# EasyEDA Pro project MotherBoard.eprj

# Schematic Schematic1
Create Date: 2024-03-08; Page Name: P1; Project Name: 机甲杯主控; Schematic Name: Schematic1; Update Date: 2024-03-14; Company: 嘉立创EDA; Page Size: A4; Version: V1.0
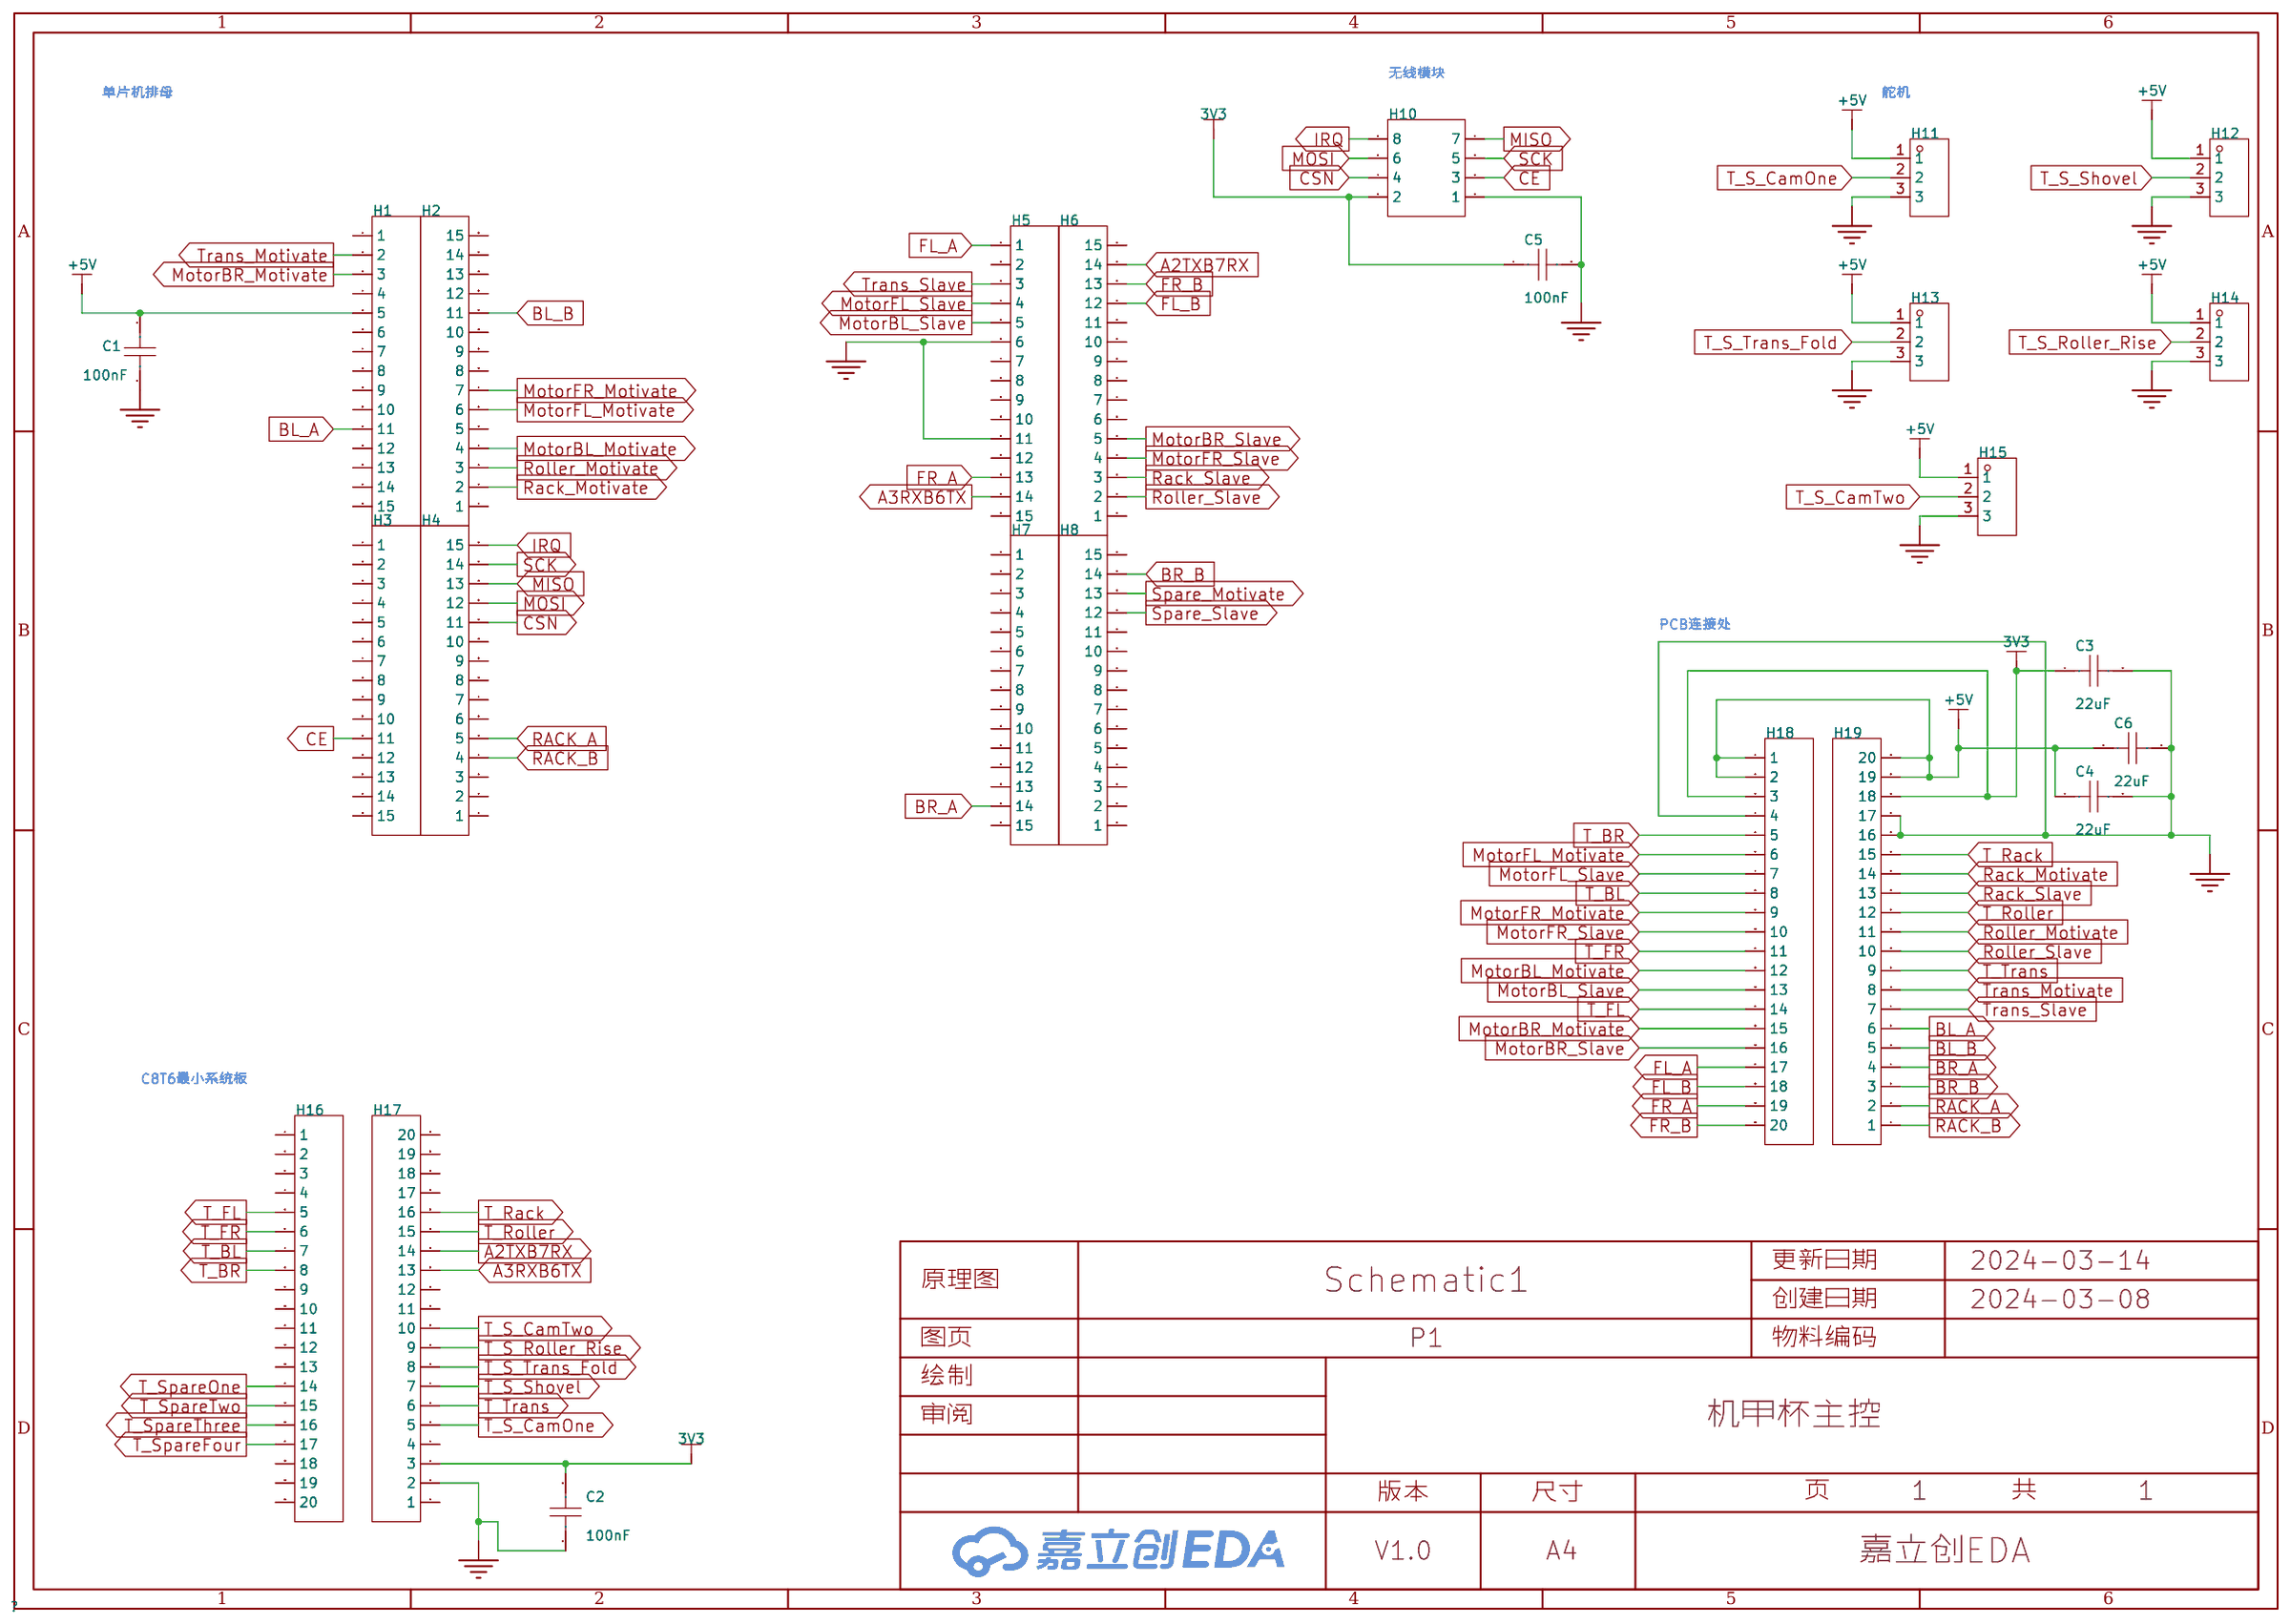
[diagram p0: schematic sheet]

## Parts
C1  100nF  [C0603]
C2  100nF  [C0603]
C3  22uF  [C0603]
C4  22uF  [C0603]
C5  100nF  [C0603]
C6  22uF  [C0603]
H1  -  [HDR-TH_15P-P2.54-V-F-1]
H2  -  [HDR-TH_15P-P2.54-V-F-1]
H3  -  [HDR-TH_15P-P2.54-V-F-1]
H4  -  [HDR-TH_15P-P2.54-V-F-1]
H5  -  [HDR-TH_15P-P2.54-V-F-1]
H6  -  [HDR-TH_15P-P2.54-V-F-1]
H7  -  [HDR-TH_15P-P2.54-V-F-1]
H8  -  [HDR-TH_15P-P2.54-V-F-1]
H10  -  [HDR-TH_8P-P2.54-V-F-R2-C4-S2.54-1]
H11  -  [HDR-TH_3P-P2.54-V-M]
H12  -  [HDR-TH_3P-P2.54-V-M]
H13  -  [HDR-TH_3P-P2.54-V-M]
H14  -  [HDR-TH_3P-P2.54-V-M]
H15  -  [HDR-TH_3P-P2.54-V-M]
H16  -  [HDR-TH_20P-P2.54-V-F]
H17  -  [HDR-TH_20P-P2.54-V-F]
H18  -  [HDR-TH_20P-P2.54-V-F]
H19  -  [HDR-TH_20P-P2.54-V-F]

## Library data of the parts
C1-C6 = CAP_0603: Supplier Footprint: 0603
H1-H8 = HDR-F_2.54_1x15P: Supplier Part: C124408; Supplier Footprint: 插件,
H10 = HDR-F_2.54_2x4: Supplier Part: C92271; Supplier Footprint: 插件
H11-H15 = HDR-M_2.54_1x3P: Supplier Part: C2937625; Supplier Footprint: 插件
H16-H19 = HDR-F_2.54_1x20P: Supplier Part: C50984; Supplier Footprint: 插件

## Nets
3V3: C2.2 C3.1 C5.1 H10.2 H17.3 H18.3 H19.18
+5V: C1.2 C4.1 C6.2 H1.5 H11.1 H12.1 H13.1 H14.1 H15.1 H18.1 H18.2 H19.19 H19.20
GND: C1.1 C2.1 C3.2 C4.2 C5.2 C6.1 H5.6 H5.11 H10.1 H11.3 H12.3 H13.3 H14.3 H15.3 H17.2 H18.4 H19.16 H19.17
A2TXB7RX: H6.14 H17.14
A3RXB6TX: H5.14 H17.13
BL_A: H1.11 H19.6
BL_B: H2.11 H19.5
BR_A: H7.14 H19.4
BR_B: H8.14 H19.3
CE: H3.11 H10.3
CSN: H4.11 H10.4
FL_A: H5.1 H18.17
FL_B: H6.12 H18.18
FR_A: H5.13 H18.19
FR_B: H6.13 H18.20
IRQ: H4.15 H10.8
MISO: H4.13 H10.7
MOSI: H4.12 H10.6
MotorBL_Motivate: H2.4 H18.12
MotorBL_Slave: H5.5 H18.13
MotorBR_Motivate: H1.3 H18.15
MotorBR_Slave: H6.5 H18.16
MotorFL_Motivate: H2.6 H18.6
MotorFL_Slave: H5.4 H18.7
MotorFR_Motivate: H2.7 H18.9
MotorFR_Slave: H6.4 H18.10
RACK_A: H4.5 H19.2
RACK_B: H4.4 H19.1
Rack_Motivate: H2.2 H19.14
Rack_Slave: H6.3 H19.13
Roller_Motivate: H2.3 H19.11
Roller_Slave: H6.2 H19.10
SCK: H4.14 H10.5
Spare_Motivate: H8.13
Spare_Slave: H8.12
T_BL: H16.7 H18.8
T_BR: H16.8 H18.5
T_FL: H16.5 H18.14
T_FR: H16.6 H18.11
T_Rack: H17.16 H19.15
T_Roller: H17.15 H19.12
T_S_CamOne: H11.2 H17.5
T_S_CamTwo: H15.2 H17.10
T_S_Roller_Rise: H14.2 H17.9
T_S_Shovel: H12.2 H17.7
T_S_Trans_Fold: H13.2 H17.8
T_SpareFour: H16.17
T_SpareOne: H16.14
T_SpareThree: H16.16
T_SpareTwo: H16.15
T_Trans: H17.6 H19.9
Trans_Motivate: H1.2 H19.8
Trans_Slave: H5.3 H19.7

Not connected (* = marked no-connect by the designer): H1 1 4 6 7 8 9 10 12 13 14 15; H2 1 5 8 9 10 12 13 14 15; H3 1 2 3 4 5 6 7 8 9 10 12 13 14 15; H4 1 2 3 6 7 8 9 10; H5 2 7 8 9 10 12 15; H6 1 6 7 8 9 10 11 15; H7 1 2 3 4 5 6 7 8 9 10 11 12 13 15; H8 1 2 3 4 5 6 7 8 9 10 11 15; H16 1 2 3 4 9 10 11 12 13 18 19 20; H17 1 4 11 12 17 18 19 20

## Notes on the sheet
- 无线模块
- 单片机排母
- 舵机
- PCB连接处
- C8T6最小系统板

# Board PCB1
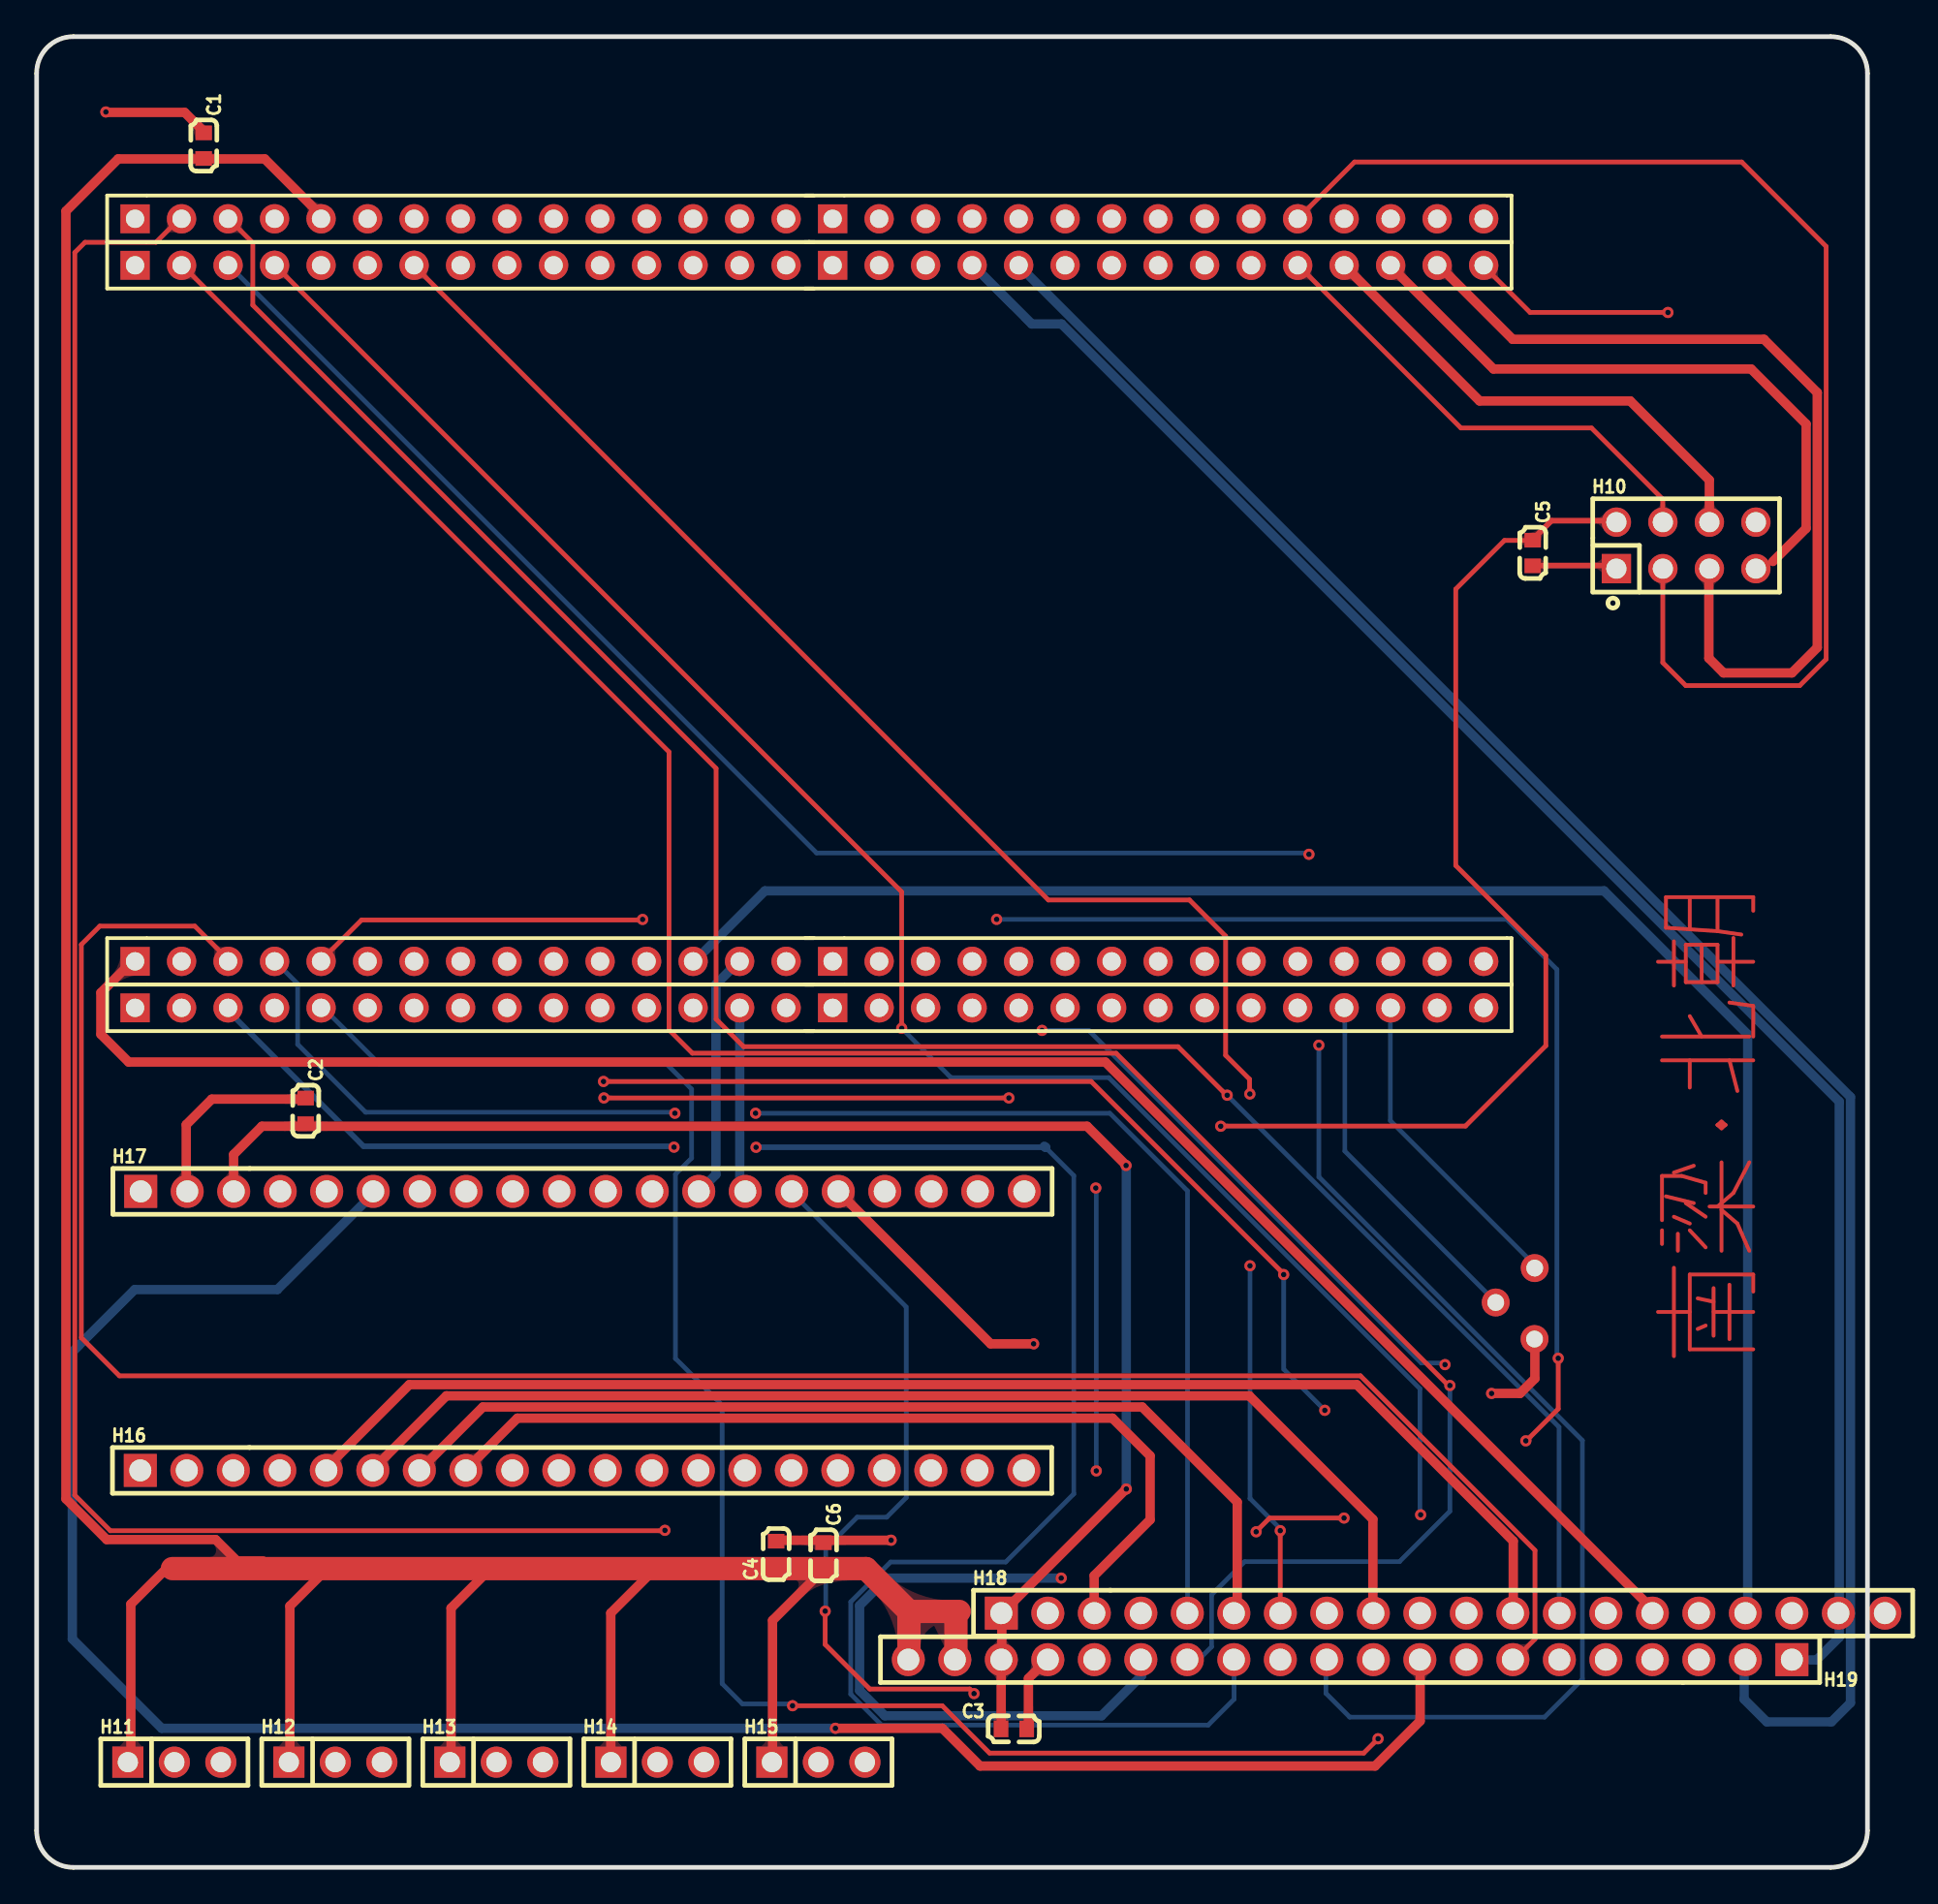
[diagram p1: board, top side]
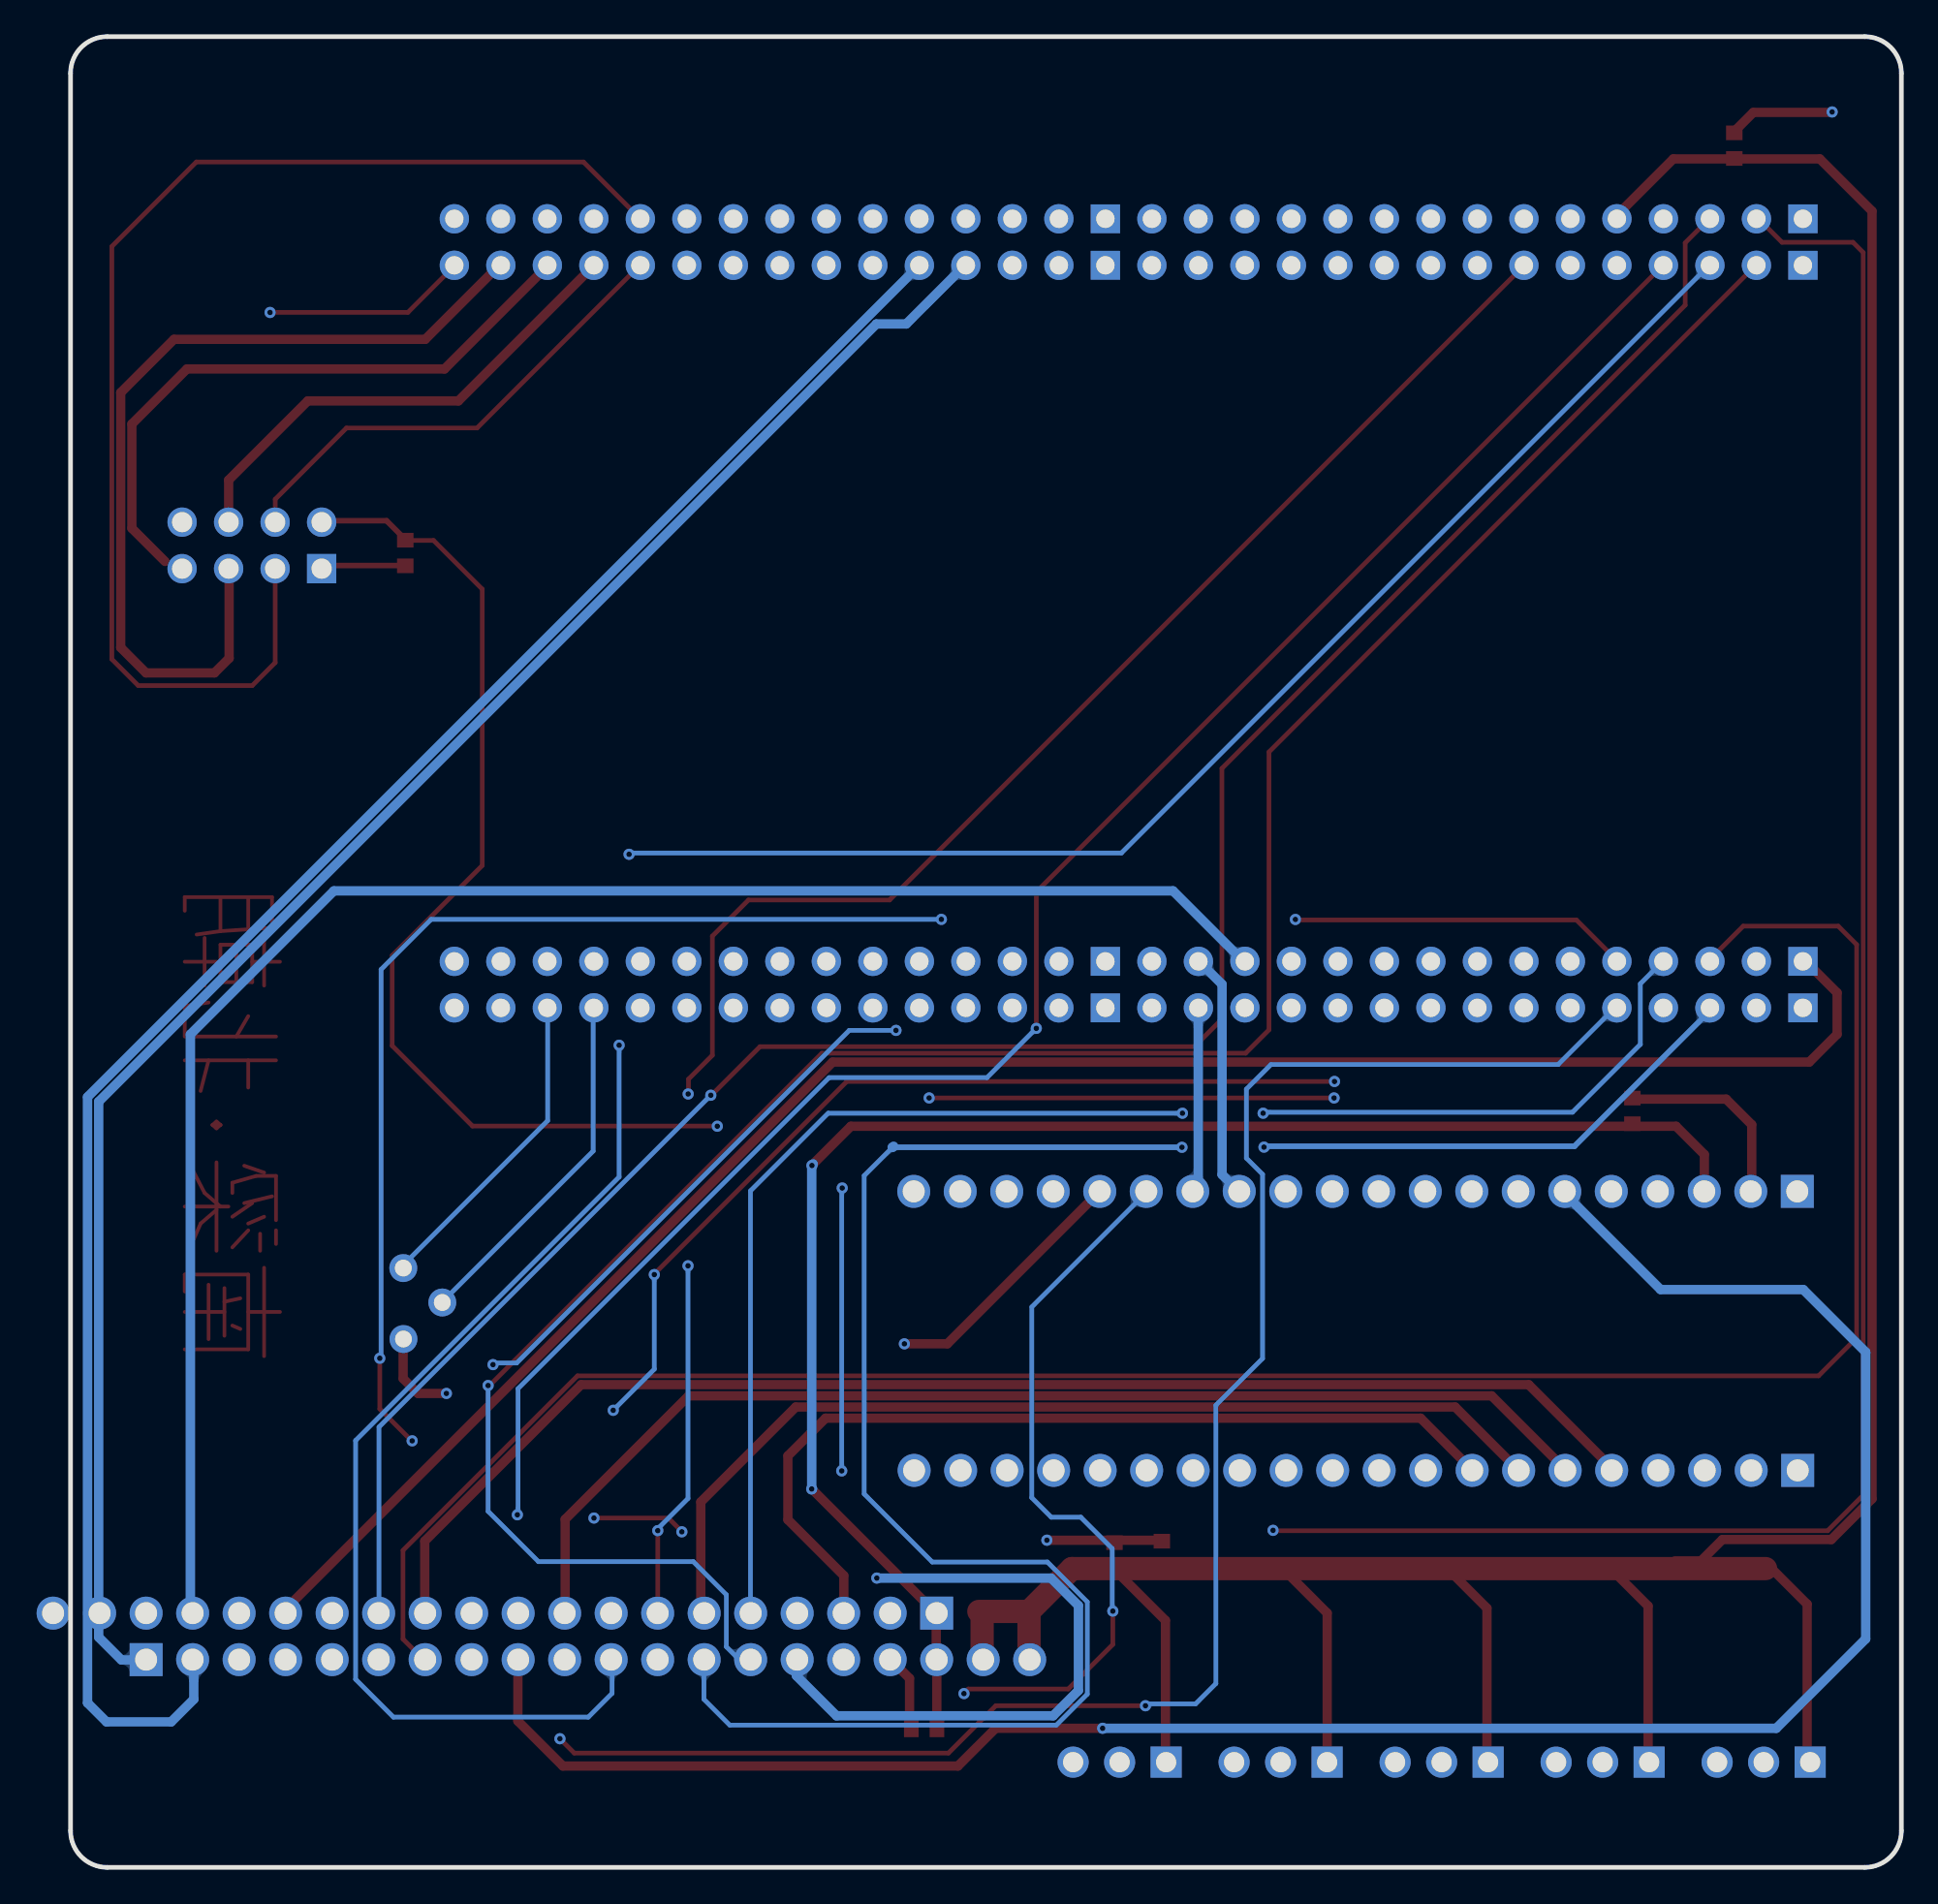
[diagram p2: board, bottom side, seen from below]

Outline 100 x 100 mm; copper layers: Top Layer, Inner1, Inner2, Bottom Layer. Coordinates in mm from the lower left corner of the outline.
Outline path: 0,98 0,2 arc(0.59,0.59) 2,0 98,0 arc(99.41,0.59) 100,2 100,98 arc(99.41,99.41) 98,100 2,100 arc(0.59,99.41) 0,98
Stack: Top Layer 0.035mm 外层铜厚1oz / Dielectric1 0.2104mm 7628 RC49% 8.6mil / Inner1 0.0152mm 内层铜厚 / Dielectric2 1.065mm 1.1mm H/HOZ 含铜 / Inner2 0.0152mm 内层铜厚 / Dielectric3 0.2104mm 7628 RC49% 8.6mil / Bottom Layer 0.035mm 外层铜厚1oz

## Design rules (mm)
template: JLCPCB Capability(Two Layers Board)
spacing copperThickness1oz (default): track to track 0.102, other pairs 0.152 to 0.3
spacing copperThickness2oz: track to track 0.203, other pairs 0.152 to 0.3
track width copperThickness1oz (default): min 0.127, default 0.254, max 2.54
track width copperThickness2oz: min 0.203, default 0.254, max 2.54
differential pair differentialPair (default): width min 0.127, default 0.254, max 2.54; gap min 0.152, default 0.152
via viaSize (default): diameter min 0.5, default 0.61, max 10; hole min 0.3, default 0.305, max 6.3

## Placement (name value [footprint] x y rotation side)
C1  100nF  [C0603]  9.13 94.04 270 top
C2  100nF  [C0603]  14.69 41.32 270 top
C3  22uF  [C0603]  53.38 7.56 0 top
C4  22uF  [C0603]  40.39 17.12 90 top
C5  100nF  [C0603]  81.71 71.79 270 top
C6  22uF  [C0603]  42.98 17.04 270 top
H1  -  [HDR-TH_15P-P2.54-V-F-1]  23.16 90.05 0 top
H2  -  [HDR-TH_15P-P2.54-V-F-1]  23.16 87.51 0 top
H3  -  [HDR-TH_15P-P2.54-V-F-1]  61.26 90.05 0 top
H4  -  [HDR-TH_15P-P2.54-V-F-1]  61.26 87.51 0 top
H5  -  [HDR-TH_15P-P2.54-V-F-1]  23.16 49.49 0 top
H6  -  [HDR-TH_15P-P2.54-V-F-1]  23.16 46.95 0 top
H7  -  [HDR-TH_15P-P2.54-V-F-1]  61.26 49.49 0 top
H8  -  [HDR-TH_15P-P2.54-V-F-1]  61.26 46.95 0 top
H10  -  [HDR-TH_8P-P2.54-V-F-R2-C4-S2.54-1]  90.09 72.21 0 top
H11  -  [HDR-TH_3P-P2.54-V-M]  7.52 5.75 0 top
H12  -  [HDR-TH_3P-P2.54-V-M]  16.32 5.75 0 top
H13  -  [HDR-TH_3P-P2.54-V-M]  25.11 5.75 0 top
H14  -  [HDR-TH_3P-P2.54-V-M]  33.91 5.75 0 top
H15  -  [HDR-TH_3P-P2.54-V-M]  42.7 5.75 0 top
H16  -  [HDR-TH_20P-P2.54-V-F]  29.79 21.68 0 top
H17  -  [HDR-TH_20P-P2.54-V-F]  29.82 36.92 0 top
H18  -  [HDR-TH_20P-P2.54-V-F]  76.82 13.89 0 top
H19  -  [HDR-TH_20P-P2.54-V-F]  71.74 11.35 180 top
NOREF  -  [Pad_e215]  79.69 30.86 0 top
NOREF#2  -  [Pad_e217]  81.82 32.74 0 top
NOREF#3  -  [Pad_e162]  81.82 28.86 0 top

## Footprints (pads in the part's own frame, mm; a bottom-side part is the same pattern mirrored in y, then rotated)
C0603
  rect 0.8x0.9 smd: 1(-0.7,0) 2(0.7,0)
HDR-TH_3P-P2.54-V-M
  rect 1.7x1.7 hole 1.1: 1(-2.54,0)
  round 1.7 hole 1.1: 2(0,0) 3(2.54,0)
HDR-TH_8P-P2.54-V-F-R2-C4-S2.54-1
  rect 1.6x1.6 hole 1.1: 1(-3.81,-1.27)
  round 1.6 hole 1.1: 2(-3.81,1.27) 3(-1.27,-1.27) 4(-1.27,1.27) 5(1.27,-1.27) 6(1.27,1.27) 7(3.81,-1.27) 8(3.81,1.27)
HDR-TH_15P-P2.54-V-F-1
  rect 1.6x1.575 hole 1: 1(-17.78,0)
  round 1.6 hole 1: 2(-15.24,0) 3(-12.7,0) 4(-10.16,0) 5(-7.62,0) 6(-5.08,0) 7(-2.54,0) 8(0,0) 9(2.54,0) 10(5.08,0) 11(7.62,0) 12(10.16,0) 13(12.7,0) 14(15.24,0) 15(17.78,0)
HDR-TH_20P-P2.54-V-F
  rect 1.8x1.8 hole 1.2: 1(-24.13,0)
  round 1.8 hole 1.2: 2(-21.59,0) 3(-19.05,0) 4(-16.51,0) 5(-13.97,0) 6(-11.43,0) 7(-8.89,0) 8(-6.35,0) 9(-3.81,0) 10(-1.27,0) 11(1.27,0) 12(3.81,0) 13(6.35,0) 14(8.89,0) 15(11.43,0) 16(13.97,0) 17(16.51,0) 18(19.05,0) 19(21.59,0) 20(24.13,0)
Pad_e162
  round 1.524 hole 0.914: 1(0,0)
Pad_e215
  round 1.524 hole 0.914: 2(0,0)
Pad_e217
  round 1.524 hole 0.914: 3(0,0)

## Nets
3V3: C2.2 C3.1 C5.1 H10.2 H17.3 H18.3 H19.18
+5V: C1.2 C4.1 C6.2 H1.5 H11.1 H12.1 H13.1 H14.1 H15.1 H18.1 H18.2 H19.19 H19.20
GND: C1.1 C2.1 C3.2 C4.2 C5.2 C6.1 H5.6 H5.11 H10.1 H11.3 H12.3 H13.3 H14.3 H15.3 H17.2 H18.4 H19.16 H19.17
A2TXB7RX: H6.14 H17.14
A3RXB6TX: H5.14 H17.13
BL_A: H1.11 H19.6
BL_B: H2.11 H19.5
BR_A: H7.14 H19.4
BR_B: H8.14 H19.3
CE: H3.11 H10.3
CSN: H4.11 H10.4
FL_A: H5.1 H18.17
FL_B: H6.12 H18.18
FR_A: H5.13 H18.19
FR_B: H6.13 H18.20
IRQ: H4.15 H10.8
MISO: H4.13 H10.7
MOSI: H4.12 H10.6
MOTORBL_MOTIVATE: H2.4 H18.12
MOTORBL_SLAVE: H5.5 H18.13
MOTORBR_MOTIVATE: H1.3 H18.15
MOTORBR_SLAVE: H6.5 H18.16
MOTORFL_MOTIVATE: H2.6 H18.6
MOTORFL_SLAVE: H5.4 H18.7
MOTORFR_MOTIVATE: H2.7 H18.9
MOTORFR_SLAVE: H6.4 H18.10
RACK_A: H4.5 H19.2
RACK_B: H4.4 H19.1
RACK_MOTIVATE: H2.2 H19.14
RACK_SLAVE: H6.3 H19.13
ROLLER_MOTIVATE: H2.3 H19.11
ROLLER_SLAVE: H6.2 H19.10
SCK: H4.14 H10.5
SPARE_MOTIVATE: H8.13 NOREF#2.3
SPARE_SLAVE: H8.12 NOREF.2
T_BL: H16.7 H18.8
T_BR: H16.8 H18.5
T_FL: H16.5 H18.14
T_FR: H16.6 H18.11
T_RACK: H17.16 H19.15
T_ROLLER: H17.15 H19.12
T_S_CAMONE: H11.2 H17.5
T_S_CAMTWO: H15.2 H17.10
T_S_ROLLER_RISE: H14.2 H17.9
T_S_SHOVEL: H12.2 H17.7
T_S_TRANS_FOLD: H13.2 H17.8
T_SPAREFOUR: H16.17
T_SPAREONE: H16.14 NOREF#3.1
T_SPARETHREE: H16.16
T_SPARETWO: H16.15
T_TRANS: H17.6 H19.9
TRANS_MOTIVATE: H1.2 H19.8
TRANS_SLAVE: H5.3 H19.7

Pads without a net: H1 1 4 6 7 8 9 10 12 13 14 15; H2 1 5 8 9 10 12 13 14 15; H3 1 2 3 4 5 6 7 8 9 10 12 13 14 15; H4 1 2 3 6 7 8 9 10; H5 2 7 8 9 10 12 15; H6 1 6 7 8 9 10 11 15; H7 1 2 3 4 5 6 7 8 9 10 11 12 13 15; H8 1 2 3 4 5 6 7 8 9 10 11 15; H16 1 2 3 4 9 10 11 12 13 18 19 20; H17 1 4 11 12 17 18 19 20

## Via types
v1: diameter 0.61, hole 0.305, Top Layer to Bottom Layer, 43 vias

## Routing (per net, layer and track width the routed paths; a pad name or vN(x,y) marks a point on that pad's centre or on a via; arc(x,y) is an arc through that point)
3V3: length 149.3
  Top Layer w0.254: 81.76,72.48 80.17,72.48 77.51,69.82 77.51,54.72 82.43,49.8 82.43,44.88 78.04,40.49 64.65,40.49
  Top Layer w0.305: 81.79,72.61 82.74,73.56 86.33,73.56
  Top Layer w0.508: 52.68,11.18 52.68,7.68 ; 52.68,11.18 52.68,11.37 52.65,11.4 ; 52.68,11.18 52.72,11.22 52.72,13.92 ; 10.91,36.73 10.76,36.88 10.76,38.94 12.31,40.48 57.38,40.48 59.49,38.37 ; 52.73,13.89 59.49,20.65
  Inner1 w0.254: v1(59.5,38.34) 61.65,40.48 v1(64.67,40.48)
  Bottom Layer w0.508: 59.44,38.43 59.52,38.35 v1(59.52,20.67)
+5V: length 205.8
  Top Layer w0.508: 13.83,5.7 13.83,14.28 15.79,16.24 ; 33.71,16.24 31.36,13.89 31.36,5.67 ; 12.37,16.74 10.94,16.74 9.78,17.91 3.83,17.91 1.6,20.13 1.6,90.47 4.46,93.32 12.46,93.32 15.61,90.16 ; 43.04,16.33 43.03,16.32 40.2,13.49 40.2,5.88 ; 24.75,16.27 22.64,14.16 22.64,5.7 ; 5.15,5.67 5.15,14.38 7.1,16.33
  Top Layer w1.27: 7.42,16.32 45.3,16.32 47.69,13.94 ; 50.21,13.85 50.21,11.5 50.05,11.34 ; 47.65,11.21 47.65,13.88 ; 47.65,13.88 47.75,13.98 50.39,13.98 ; 47.65,13.88 47.65,13.9
GND: length 327.2
  Top Layer w0.305: 81.71,71.11 86.25,71.11 86.27,71.08
  Top Layer w0.508: 8.17,36.83 8.17,40.57 9.57,41.96 14.42,41.96 ; 46.55,17.88 46.53,17.87 40.4,17.87 ; 54.17,7.55 54.17,10.32 55.15,11.3 ; 3.86,95.86 8.09,95.86 9.11,94.83
  Inner2 w0.508: 37.46,2.57 36.44,3.59 36.44,5.69 ; 45.2,5.72 45.2,4.05 46.71,2.54 ; 10.07,5.75 10.07,3.72 11.2,2.59 ; 8.22,36.94 5.88,34.6 2.57,34.6 1.27,35.9 1.27,52.93 4.11,55.78 20.02,55.78 ; 30.58,53.89 30.73,53.73 30.73,49.46 ; 59.21,2.28 59.21,10.02 57.8,11.43 ; v1(3.78,95.88) 2.14,94.25 2.14,60.98 6.38,56.75 70.65,56.75 ; 27.6,5.8 27.6,4.16 29.21,2.54 ; 55.24,11.35 55.14,11.25 ; 55.24,11.35 55.24,13.94 ; 55.24,11.35 56.88,9.71 56.88,2.28 ; v1(46.67,17.87) 56.59,17.87 57.8,16.66 ; 55.24,13.94 55.24,13.99 ; 55.24,13.94 79.28,37.98 87.56,37.98 ; 18.81,5.85 18.81,4.05 19.99,2.88 ; 18.13,49.51 18.13,53.09 20.71,55.68 ; 85.34,71.45 70.65,56.76
  Inner2 w1.27: 66.74,53.84 84.46,53.84 84.5,53.8
A2TXB7RX: length 10.2
  Bottom Layer w0.508: 38.73,36.92 38.41,37.24 38.41,46.96
A3RXB6TX: length 13.5
  Bottom Layer w0.508: 36.14,36.88 37.1,37.84 37.1,48.23 38.36,49.49
BL_A: length 168
  Inner1 w0.508: 83.09,11.39 83.09,9.2 85.88,6.4 96.63,6.4 99.08,8.85 99.08,82.6 88.64,93.04 33.88,93.04 30.8,89.96
BL_B: length 138.8
  Inner1 w0.508: 85.68,11.24 85.68,9.01 87.68,7.01 96.38,7.01 98.47,9.1 98.47,46.43 68.06,76.84 41.45,76.84 30.77,87.51
BR_A: length 66.9
  Inner1 w0.508: 76.55,49.43 76.62,49.43 78.19,51 80.85,51 97.86,33.99 97.86,9.36 96.13,7.62 89.62,7.62 88.19,9.05 88.19,11.28 88.14,11.33
BR_B: length 55.4
  Inner1 w0.508: 90.77,11.28 90.8,11.25 90.8,9.36 91.92,8.23 95.87,8.23 97.25,9.61 97.25,26.28 76.55,46.98
CE: length 69.6
  Top Layer w0.254: 88.82,70.82 88.82,65.81 90.07,64.55 96.3,64.55 97.74,66 97.74,88.54 93.13,93.15 71.98,93.15 68.88,90.05
CSN: length 26.6
  Top Layer w0.254: 88.82,73.39 88.82,74.73 84.93,78.62 77.79,78.62 68.86,87.56
FL_A: length 103
  Top Layer w0.508: 88.49,13.87 58.37,43.99 5.03,43.99 3.51,45.51 3.51,47.77 5.39,49.66
FL_B: length 81.1
  Inner1 w0.305: 32.4,40.77 32.4,46.03 33.33,46.96 ; 32.4,40.77 32.4,33.78 35.15,31.03 75.24,31.03 90.79,15.48 90.79,13.91 ; 32.4,40.77 32.4,40.78
FR_A: length 93.8
  Bottom Layer w0.508: 93.45,14.02 93.45,45.5 85.61,53.34 39.78,53.34 35.94,49.5
FR_B: length 81.1
  Inner1 w0.508: 35.79,46.99 38.69,44.09 78.58,44.09 95.79,26.87 95.79,14.11
IRQ: length 24.9
  Top Layer w0.254: 89.11,84.94 81.57,84.94 79,87.51
  Inner1 w0.254: 93.69,73.15 93.69,80.35 v1(89.1,84.93)
MISO: length 34.6
  Top Layer w0.508: 94.84,71.33 96.65,73.14 96.65,78.84 93.64,81.84 79.57,81.84 73.92,87.49
MOSI: length 27
  Top Layer w0.508: 91.36,73.56 91.36,75.78 87.04,80.1 78.82,80.1 71.43,87.48
MOTORBL_MOTIVATE: length 104.4
  Top Layer w0.254: 13.02,87.51 47.25,53.28 47.25,45.93
  Inner1 w0.254: 75.57,13.83 75.59,13.85 v1(75.59,19.26)
  Bottom Layer w0.254: 75.56,19.38 75.56,26.15 58.57,43.14 49.94,43.14 v1(47.25,45.83)
MOTORBL_SLAVE: length 106.9
  Top Layer w0.254: 33.12,51.75 17.75,51.75 15.52,49.52 ; 81.34,23.27 83.11,25.04 v1(83.11,27.81)
  Inner1 w0.254: 78.01,13.89 81.34,17.23 v1(81.34,23.3) ; v1(33.1,51.78) 52.43,51.78 v1(52.44,51.78)
  Bottom Layer w0.254: 83.11,27.86 83.04,27.93 83.04,49.05 80.3,51.78 v1(52.44,51.78)
MOTORBR_MOTIVATE: length 120.1
  Top Layer w0.254: 65.04,42.13 62.34,44.83 38.62,44.83 37.11,46.33 37.11,60.03 11.81,85.33 11.81,88.74 10.5,90.05
  Bottom Layer w0.254: 83.15,13.94 83.15,24.05 v1(65.03,42.18)
MOTORBR_SLAVE: length 111.2
  Top Layer w0.254: v1(41.29,8.83) 49.46,8.83 52.05,6.24 72.48,6.24 v1(73.27,7.03)
  Inner1 w0.254: v1(73.27,7.03) 74.28,8.04 74.28,11.81 75.08,12.61 84.51,12.61 85.76,13.86
  Bottom Layer w0.254: 41.34,8.86 41.26,8.93 38.55,8.93 37.44,10.04 37.44,25.25 34.89,27.8 34.89,37.86 35.78,38.74 35.78,42.51 34.43,43.85 18.75,43.85 15.63,46.97
MOTORFL_MOTIVATE: length 115.3
  Top Layer w0.254: v1(71.41,19.08) 67.34,19.08 66.59,18.33
  Inner1 w0.254: 71.52,19.13 72.69,20.31 76.95,20.31 78.87,22.22 78.87,25.47 76.92,27.41 v1(76.92,27.46) ; v1(66.61,18.33) 65.19,16.91 61.78,16.91 60.32,15.46 60.32,13.89 ; 18.04,87.51 54.92,50.63 54.92,45.82
  Bottom Layer w0.254: v1(54.91,45.72) 57.47,45.72 75.63,27.55 76.89,27.55
MOTORFL_SLAVE: length 80.1
  Inner1 w0.305: v1(34.86,41.19) v1(39.27,41.19)
  Bottom Layer w0.254: 58.6,41.19 v1(39.27,41.19) ; 62.86,13.81 62.86,36.95 58.61,41.2 ; 13.02,49.5 14.26,48.26 14.26,44.95 17.96,41.25 34.8,41.25 v1(34.86,41.19)
MOTORFR_MOTIVATE: length 97.6
  Top Layer w0.254: v1(67.93,18.39) 67.93,13.92 67.91,13.91 ; 66.25,42.26 66.25,43.05 64.94,44.36 64.94,50.87 62.97,52.84 55.26,52.84 20.57,87.53
  Inner1 w0.254: v1(66.27,42.24) 66.27,32.87 v1(66.27,32.86)
  Bottom Layer w0.254: v1(66.27,32.86) 66.27,20.15 67.94,18.49
MOTORFR_SLAVE: length 80.2
  Top Layer w0.254: 68.06,32.47 57.6,42.93 v1(30.96,42.93)
  Inner1 w0.254: 30.93,42.98 30.91,42.96 16.96,42.96 12.97,46.95
  Inner1 w0.508: 70.34,24.92 70.4,24.86 70.4,14.09
  Bottom Layer w0.254: v1(68.11,32.38) 68.11,27.21 v1(70.36,24.97)
RACK_A: length 106.4
  Bottom Layer w0.508: 93.27,11.41 93.27,9.18 94.5,7.95 98.03,7.95 99.07,8.99 99.07,42.08 53.6,87.55
RACK_B: length 98.7
  Bottom Layer w0.508: 51.1,87.56 54.35,84.31 55.98,84.31 98.46,41.83 98.46,12.57 97.22,11.33 95.85,11.33
RACK_MOTIVATE: length 129.9
  Top Layer w0.254: 7.98,87.49 34.54,60.93 34.54,45.75 35.82,44.47 58.96,44.47 77.16,26.28 77.24,26.28
  Bottom Layer w0.254: 62.74,11.34 63.47,11.34 64.18,12.05 64.18,14.89 65.99,16.7 74.44,16.7 77.19,19.45 v1(77.19,26.32)
RACK_SLAVE: length 111.5
  Inner1 w0.305: v1(34.81,39.34) 39.29,39.34 v1(39.29,39.33)
  Bottom Layer w0.254: 65.37,11.26 65.4,11.22 65.4,9.18 63.99,7.77 46.16,7.77 44.47,9.46 44.47,14.5 46.64,16.68 52.93,16.68 56.65,20.4 56.65,37.78 55.1,39.33
  Bottom Layer w0.305: v1(34.81,39.34) 34.77,39.39 17.85,39.39 10.38,46.86 ; v1(39.29,39.33) 55.1,39.33
  Bottom Layer w0.508: 55.12,39.33 55.1,39.33 55.04,39.39
ROLLER_MOTIVATE: length 140.8
  Inner1 w0.254: v1(69.49,55.34) 69.57,55.34 70.06,54.85 70.06,45
  Bottom Layer w0.254: 69.57,55.28 69.45,55.41 42.6,55.41 10.48,87.52 ; v1(70.04,44.91) 70.04,37.71 84.43,23.32 84.43,10.27 82.36,8.21 71.72,8.21 70.42,9.51 70.42,11.25
ROLLER_SLAVE: length 124.7
  Top Layer w0.254: 52.98,42.04 52.97,42.03 v1(30.99,42.03)
  Inner1 w0.254: 73.04,11.25 73.04,8.41 71.24,6.6 47.81,6.6 44.48,9.93 44.48,13.19 47.17,15.88 54.53,15.88 57.9,19.26 57.9,21.69 57.88,21.71 ; 30.94,42.03 30.93,42.04 12.72,42.04 7.82,46.93 ; 53.02,42.04 57.9,37.16
  Bottom Layer w0.254: v1(57.88,21.66) 57.88,37.08 v1(57.85,37.11)
  vias: v1(53.1,42.03)
SCK: length 49.2
  Top Layer w0.508: 76.51,87.58 80.62,83.47 94.35,83.47 97.26,80.55 97.26,66.63 95.88,65.25 92.14,65.25 91.34,66.05 91.34,70.8 91.4,70.86
SPARE_MOTIVATE: length 17.6
  Bottom Layer w0.254: 82.01,32.72 73.94,40.79 73.94,46.94
SPARE_SLAVE: length 19.5
  Bottom Layer w0.254: 79.68,30.9 71.45,39.13 71.45,46.97
T_BL: length 54.2
  Top Layer w0.508: 65.58,14.09 65.58,19.96 60.39,25.15 24.37,25.15 20.81,21.59
T_BR: length 49.4
  Top Layer w0.508: 57.76,13.72 57.76,15.94 60.82,18.99 60.82,22.48 58.76,24.54 26.26,24.54 23.46,21.73
T_FL: length 74.2
  Top Layer w0.508: 80.65,14.02 80.65,17.82 72.11,26.37 20.36,26.37 15.7,21.71
T_FR: length 64
  Top Layer w0.508: 18.16,21.54 22.38,25.76 66.24,25.76 72.98,19.01 72.98,14.37
T_RACK: length 67.8
  Top Layer w0.508: 43.85,36.86 52.11,28.6 v1(54.45,28.6)
  Inner1 w0.508: 56.14,15.78 59.07,15.78 61.61,18.32 61.61,21.45 v1(54.45,28.6)
  Bottom Layer w0.508: 60.35,11.33 60.35,10.47 58.16,8.28 46.33,8.28 44.95,9.66 44.95,14.3 46.45,15.8 v1(55.96,15.8)
T_ROLLER: length 56.8
  Top Layer w0.254: 51.19,9.51 50.96,9.74 45.51,9.74 43.07,12.18 v1(43.07,14)
  Inner1 w0.254: 68.02,11.31 66.2,9.49 v1(51.2,9.49)
  Bottom Layer w0.254: 43.12,14.05 43.1,14.07 43.1,17.41 44.82,19.13 46.43,19.13 47.5,20.19 47.5,30.61 41.24,36.86
T_S_CAMONE: length 43.7
  Inner1 w0.508: 7.52,5.79 7.52,9.17 1.08,15.61 1.08,28.64 6.43,33.99 12.81,33.99 15.81,36.99
T_S_CAMTWO: length 85.7
  Inner1 w0.508: 28.58,36.92 23.08,31.42 7.31,31.42 3.54,27.65 3.54,16.6 7.71,12.43 39.54,12.43 42.65,9.32 42.65,5.75 42.57,5.67
T_S_ROLLER_RISE: length 75.8
  Inner1 w0.508: 26.03,36.98 21.14,32.09 7.11,32.09 2.93,27.9 2.93,16.35 7.46,11.82 31.2,11.82 33.95,9.07 33.95,5.8 34.03,5.88 ; 33.88,5.83 33.87,5.83
T_S_SHOVEL: length 55.5
  Inner1 w0.508: 20.88,36.96 17.29,33.37 6.67,33.37 1.69,28.39 1.69,15.86 6.95,10.6 13.72,10.6 16.29,8.03 16.29,5.68
T_S_TRANS_FOLD: length 65.7
  Inner1 w0.508: 23.39,37.01 19.08,32.7 6.86,32.7 2.3,28.14 2.3,16.12 7.21,11.21 22.64,11.21 25.11,8.74 25.11,5.74 25.15,5.7
T_SPAREONE: length 50.5
  Top Layer w0.508: v1(79.47,25.89) 81.02,25.89 81.83,26.7 81.83,28.8
  Inner1 w0.508: 79.41,25.98 75.64,29.75 46.78,29.75 38.64,21.62
T_TRANS: length 116.6
  Top Layer w0.508: 75.57,11.33 75.57,8 73.11,5.54 51.53,5.54 49.47,7.6 v1(43.63,7.6)
  Bottom Layer w0.508: 18.46,36.87 13.15,31.56 5.36,31.56 1.95,28.15 1.95,12.48 6.83,7.6 43.6,7.6
TRANS_MOTIVATE: length 161.9
  Top Layer w0.254: 7.84,90.09 6.52,88.77 2.64,88.77 2.09,88.21 2.09,20.33 4.03,18.39 34.19,18.39 34.2,18.41
  Inner1 w0.254: 78.07,7.35 78.07,11.3 ; 77.87,4.62 80.61,7.35 ; 75.33,4.62 48.11,4.62 v1(34.32,18.41)
TRANS_SLAVE: length 121.4
  Top Layer w0.254: 10.54,49.51 8.64,51.41 3.45,51.41 2.44,50.41 2.44,28.93 4.52,26.85 72.31,26.85 81.84,17.32 81.84,12.47 80.72,11.36

## Copper pours and planes (outline as drawn; the poured copper is in the pictures)
GND on Inner2: 19.86,62.55 68.47,62.55 68.47,53.02 19.86,53.02
GND on Inner2: 3.77,3.53 60.42,3.53 60.42,0.79 3.77,0.79
GND on Inner2: 82.24,59.51 94.56,59.51 94.56,36.16 82.24,36.16

Small or netless copper shapes (teardrops, artwork), in the pictures only: 85 on Top Layer, 37 on Bottom Layer, 53 on Inner1, 11 on Inner2

## Text on the board
Top Layer: 南梁·北朝
